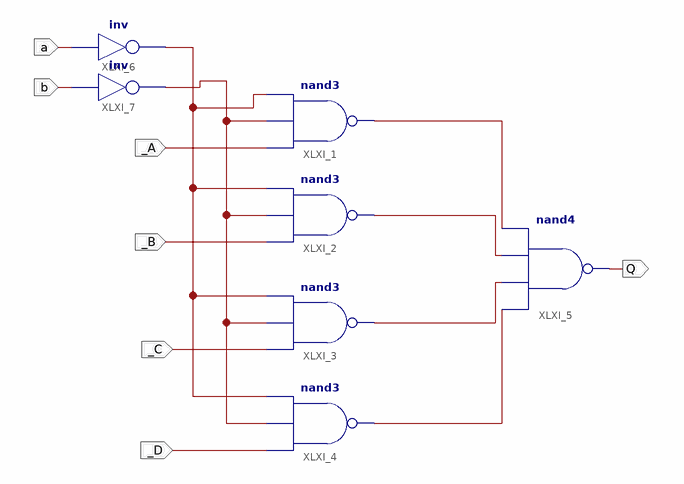
[diagram p0: schematic sheet 1]
// Xilinx ISE schematic TwoInput4BitMUX.sch (spartan3e) as structural Verilog: 7 symbols, 7 ports
module TwoInput4BitMUX (
  input  _A,
  input  _B,
  input  _C,
  input  _D,
  input  a,
  input  b,
  output Q
);

  wire XLXN_1, XLXN_2, XLXN_3, XLXN_4, XLXN_10, XLXN_23;

  nand XLXI_1 (XLXN_1, _A, XLXN_23, XLXN_10);
  nand XLXI_5 (Q, XLXN_4, XLXN_3, XLXN_2, XLXN_1);
  nand XLXI_2 (XLXN_2, _B, XLXN_23, XLXN_10);
  nand XLXI_3 (XLXN_3, _C, XLXN_23, XLXN_10);
  nand XLXI_4 (XLXN_4, _D, XLXN_23, XLXN_10);
  not XLXI_6 (XLXN_10, a);
  not XLXI_7 (XLXN_23, b);
endmodule
